# EAGLE design ain (EAGLE 6.5.0)
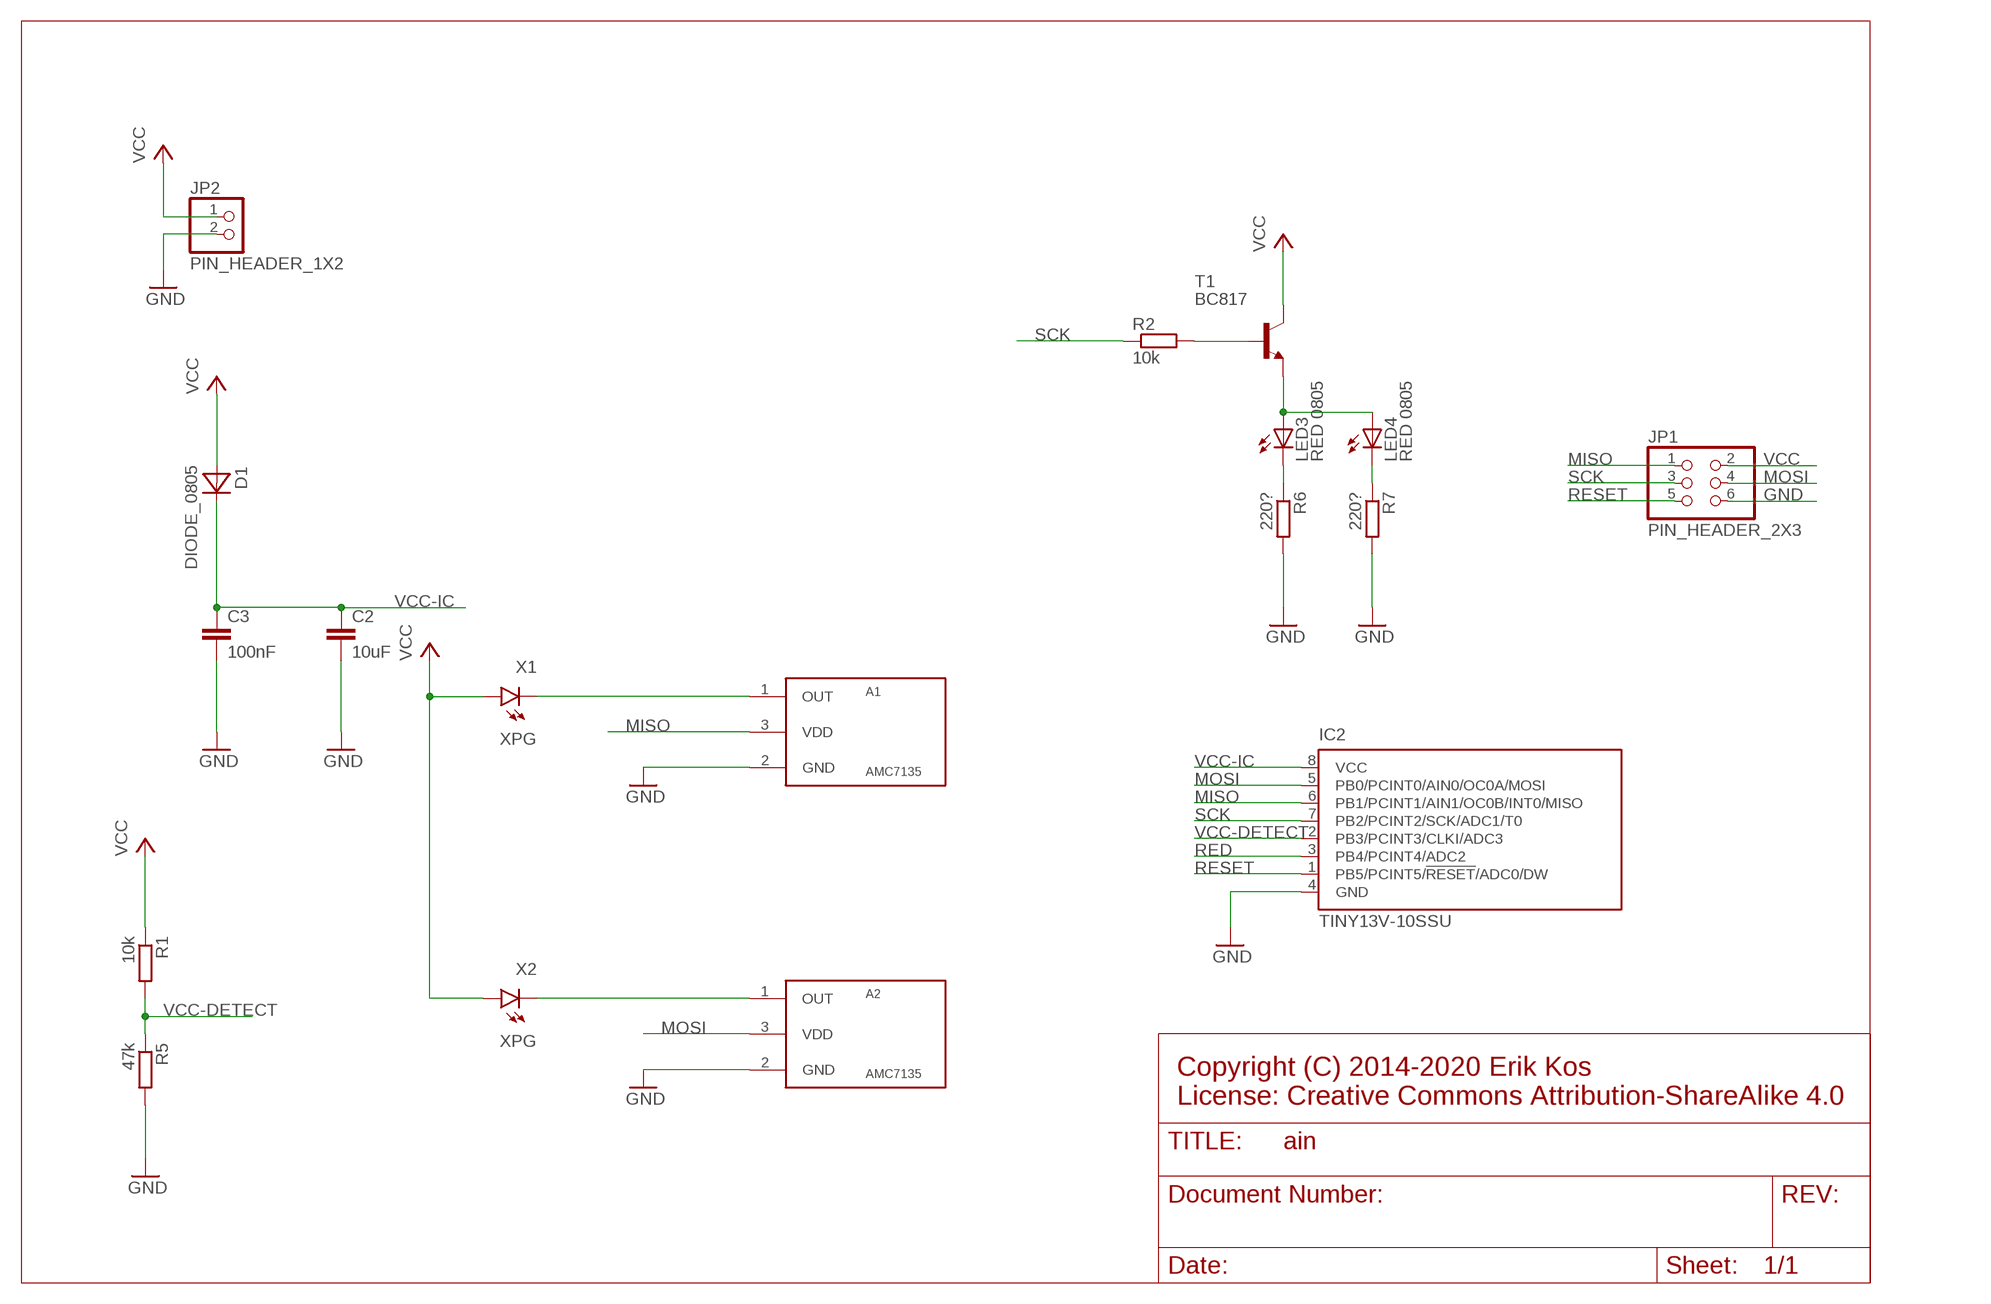
[diagram p0: schematic, sheet 1]

## Parts
A1  AMC7135  [SOT-89]
A2  AMC7135  [SOT-89]
C2  10uF  C-EUC0805  [C0805]
C3  100nF  C-EUC0805  [C0805]
D1  DIODE_0805  [0805]
IC2  TINY13V-10SSU  [8S1]
JP1  PIN_HEADER_2X3  [PIN_HEADER_2X3]
JP2  PIN_HEADER_1X2  [PIN_HEADER_1X2]
LED3  RED 0805  LEDSML0805  [SML0805]
LED4  RED 0805  LEDSML0805  [SML0805]
R1  10k  R-EU_M0805  [M0805]
R2  10k  R-EU_M0805  [M0805]
R5  47k  R-EU_M0805  [M0805]
R6  220?  R-EU_M0805  [M0805]
R7  220?  R-EU_M0805  [M0805]
T1  BC817  BC817-25-NPN-SOT23-BEC  [SOT23-BEC]
X1  XPG  [XPG]
X2  XPG  [XPG]

## Nets
GND: A1.2(GND) A2.2(GND) C2.2 C3.2 IC2.4(GND) JP1.6 JP2.2 R5.2 R6.2 R7.2
MISO: A1.3(VDD) IC2.6(PB1/PCINT1/AIN1/OC0B/INT0/MISO) JP1.1
MOSI: A2.3(VDD) IC2.5(PB0/PCINT0/AIN0/OC0A/MOSI) JP1.4
N$3: A2.1(OUT) X2.2(C)
N$4: A1.1(OUT) X1.2(C)
N$7: R2.2 T1.B
N$8: LED3.A LED4.A T1.E
N$9: LED4.C R7.1
N$10: LED3.C R6.1
RED: IC2.3(PB4/PCINT4/ADC2)
RESET: IC2.1(PB5/PCINT5/!RESET!/ADC0/DW) JP1.5
SCK: IC2.7(PB2/PCINT2/SCK/ADC1/T0) JP1.3 R2.1
VCC: D1.1(A) JP1.2 JP2.1 R1.1 T1.C X1.1(A) X2.1(A)
VCC-DETECT: IC2.2(PB3/PCINT3/CLKI/ADC3) R1.2 R5.1
VCC-IC: C2.1 C3.1 D1.2(C) IC2.8(VCC)

## Notes on the sheet
- Copyright (C) 2014-2020 Erik Kos
  License: Creative Commons Attribution-ShareAlike 4.0

## Library data of the parts
A1 A2 = js:AMC7135: AMC7135
C2 C3 = rcl:C-EU: CAPACITOR, European symbol
D1 = js:DIODE_0805
IC2 = atmel:TINY13: 8-bit AVR Microcontroller with 1K Bytes In-System Programmable Flash Source: http://www.atmel.com/dyn/resources/prod_documents/2535S.pdf; MPN: ATTINY13V-10SSU; OC_FARNELL: 1455135; OC_NEWARK: 58M3773
JP1 = js:PIN_HEADER_2X3
JP2 = js:PIN_HEADER_1X2
LED3 LED4 = led:LED: LED OSRAM: - CHIPLED LG R971, LG N971, LY N971, LG Q971, LY Q971, LO R971, LY R971 LH N974, LH R974 LS Q976, LO Q976, LY Q976 LO Q996 - Hyper CHIPLED LW Q18S LB Q993, LB Q99A, LB R99A - SideLED LS A670, LO A670, LY A670, LG A670, LP A670 LB A673, LV A673, LT A673, LW A673 LH A674 LY A675 LS A676, LA A676, LO A676, LY A676, LW A676 LS A679, LY A679, LG A679 - Hyper Micro SIDELED® LS Y876, LA Y876, LO Y876, LY Y876 LT Y87S - SmartLED LW L88C, LW L88S LB L89C, LB L89S, LG L890 LS L89K, LO L89K, LY L89K LS L896, LA L896, LO L896, LY L896 - TOPLED LS T670, LO T670, LY T670, LG T670, LP T670 LSG T670, LSP T670, LSY T670, LOP T670, LYG T670 LG T671, LOG T671, LSG T671 LB T673, LV T673, LT T673, LW T673 LH T674 LS T676, LA T676, LO T676, LY T676, LB T676, LH T676, LSB T676, LW T676 LB T67C, LV T67C, LT T67C, LS T67K, LO T67K, LY T67K, LW E67C LS E67B, LA E67B, LO E67B, LY E67B, LB E67C, LV E67C, LT E67C LW T67C LS T679, LY T679, LG T679 LS T770, LO T770, LY T770, LG T770, LP T770 LB T773, LV T773, LT T773, LW T773 LH T774 LS E675, LA E675, LY E675, LS T675 LS T776, LA T776, LO T776, LY T776, LB T776 LHGB T686 LT T68C, LB T68C - Hyper Mini TOPLED® LB M676 - Mini TOPLED Santana® LG M470 LS M47K, LO M47K, LY M47K Source: http://www.osram.convergy.de LUXEON: - LUMILED® LXK2-PW12-R00, LXK2-PW12-S00, LXK2-PW14-U00, LXK2-PW14-V00 LXK2-PM12-R00, LXK2-PM12-S00, LXK2-PM14-U00 LXK2-PE12-Q00, LXK2-PE12-R00, LXK2-PE12-S00, LXK2-PE14-T00, LXK2-PE14-U00 LXK2-PB12-K00, LXK2-PB12-L00, LXK2-PB12-M00, LXK2-PB14-N00, LXK2-PB14-P00, LXK2-PB14-Q00 LXK2-PR12-L00, LXK2-PR12-M00, LXK2-PR14-Q00, LXK2-PR14-R00 LXK2-PD12-Q00, LXK2-PD12-R00, LXK2-PD12-S00 LXK2-PH12-R00, LXK2-PH12-S00 LXK2-PL12-P00, LXK2-PL12-Q00, LXK2-PL12-R00 Source: www.luxeon.com KINGBRIGHT: KA-3528ASYC Source: www.kingbright.com
R1 R2 R5-R7 = rcl:R-EU_: RESISTOR, European symbol
T1 = transistor:*-NPN-: NPN Transistror BF959 corrected 2008.03.06
X1 X2 = js:XPG

## Net classes
0 default: clearance 0.205 mm

## Board
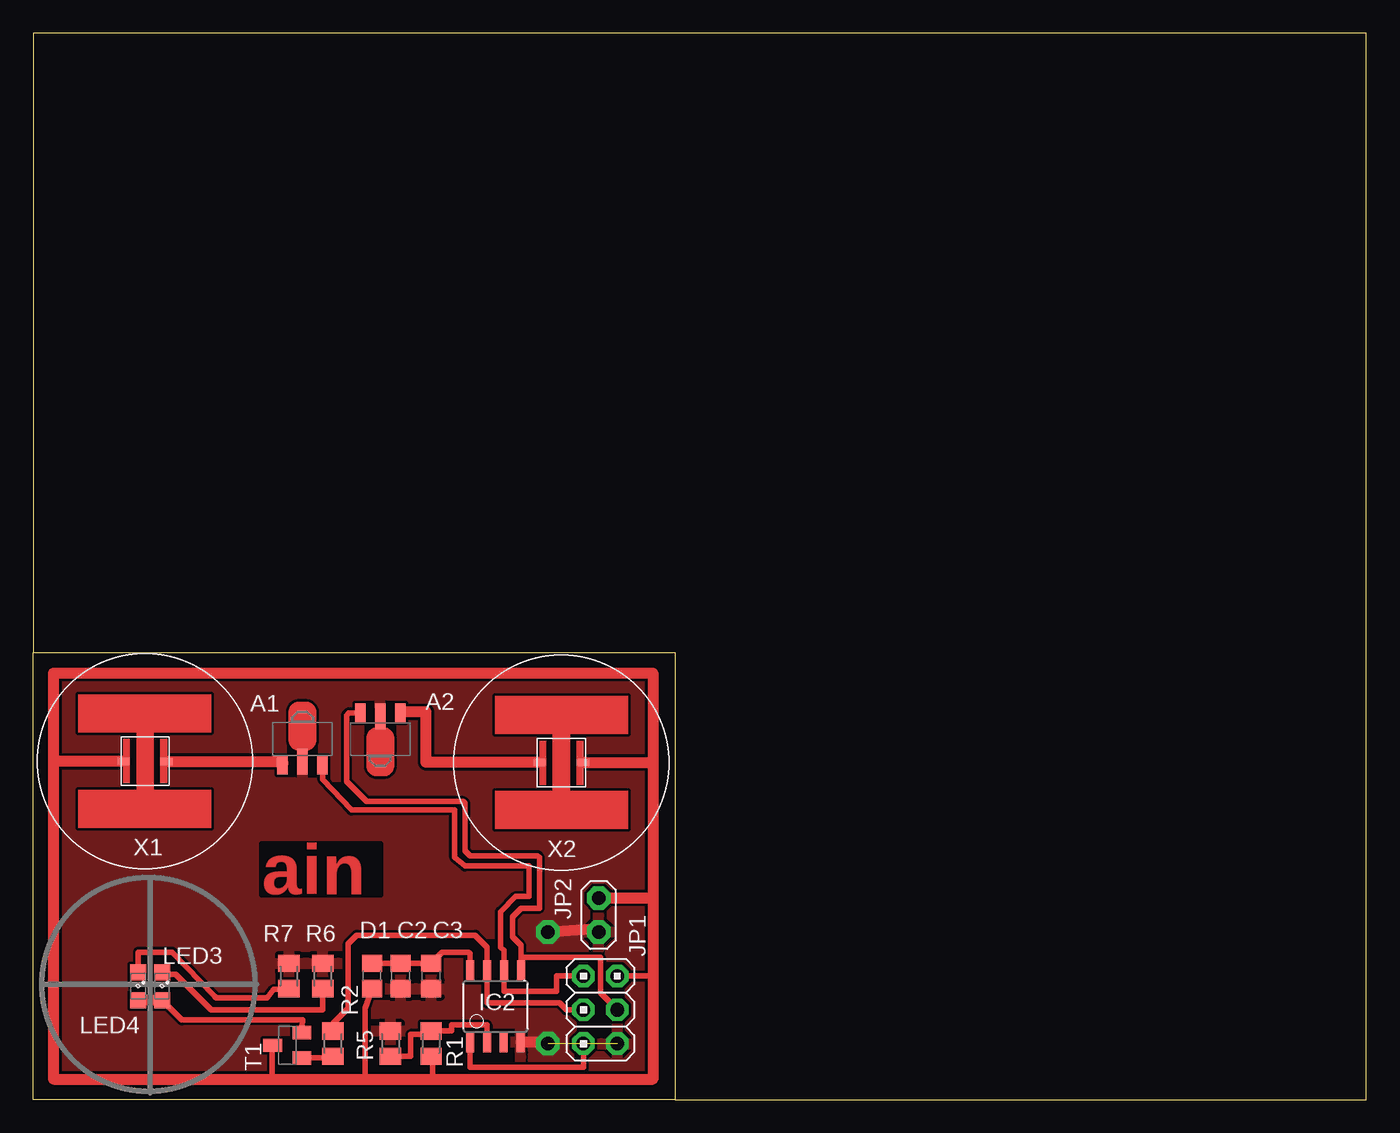
[diagram p1: board, top side]
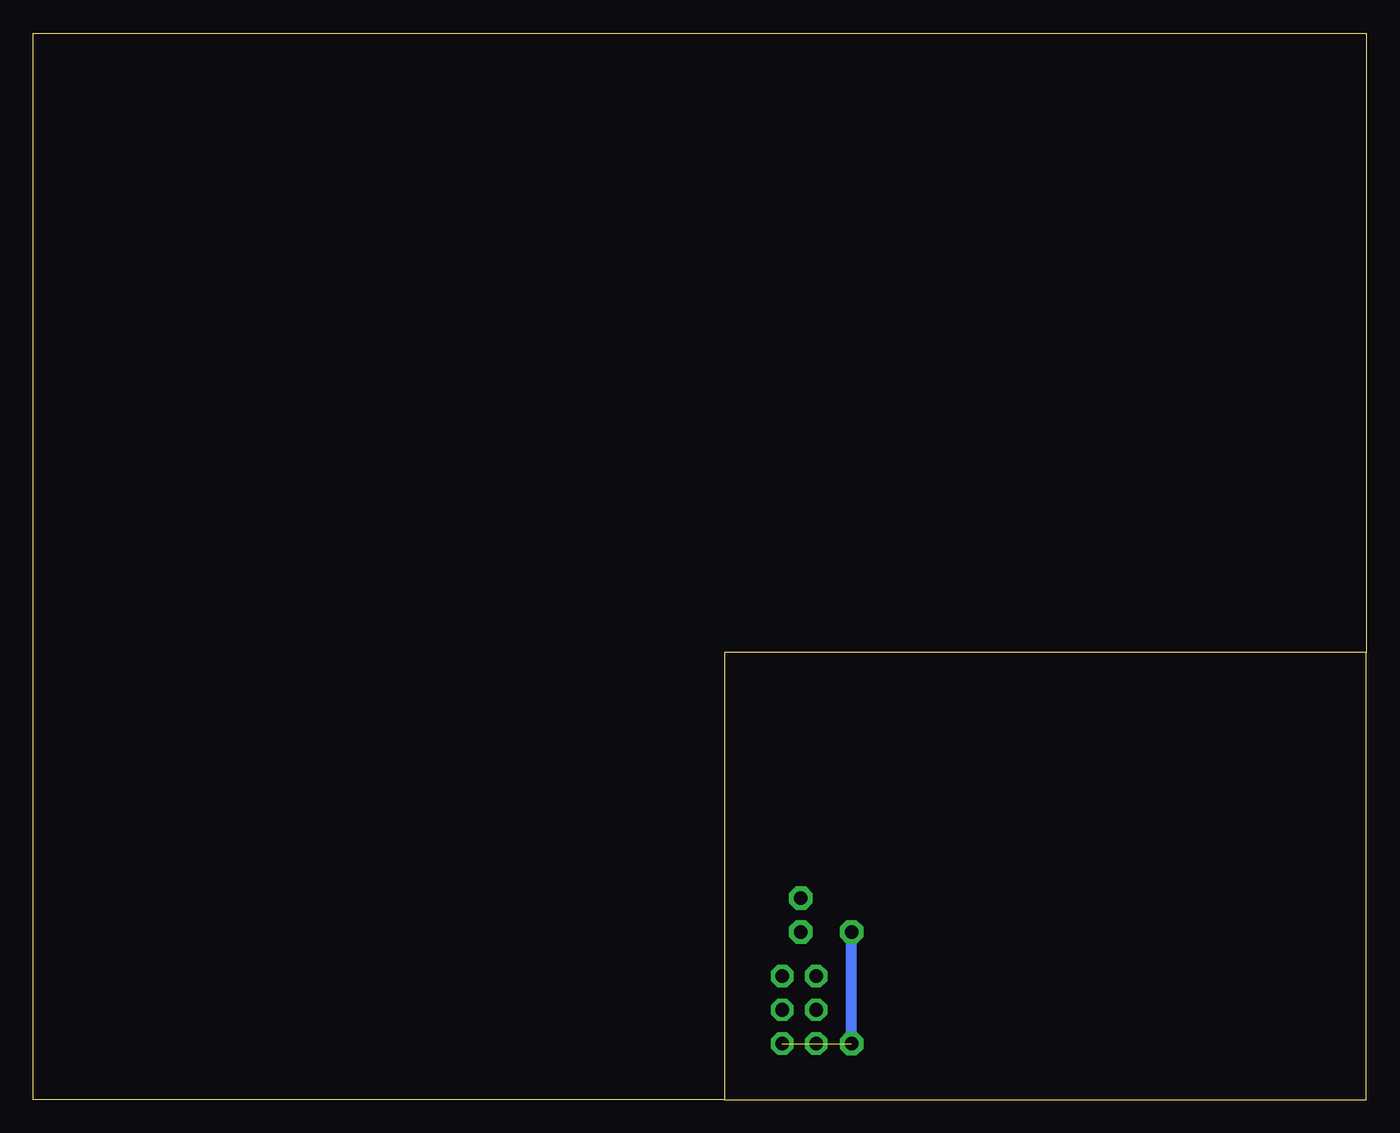
[diagram p2: board, bottom side, seen from below]

Size 100 x 80 mm. Coordinates in mm from the lower left corner, seen from the top.
Outline: 48.13,0 100,0 100,80 0,80 0,33.53
Outline: 0,33.53 48.13,33.53 48.13,0
Outline: 48.13,0 0,0 0,33.53
Copper layers (1*16): Top 0.035mm / dielectric 1.5mm / Bottom 0.035mm
Design rules "default": minimum track width 10mil, minimum drill 24mil, track to track 8mil, track to pad 8mil, pad to pad 8mil, via to via 8mil, smd to smd 8mil, copper to edge 40mil, drill to drill 8mil, minimum pad ring 10mil, minimum via ring 8mil, stop-mask expansion 4mil, vias tented up to drill 0mil, thermal gap 10mil

### Footprints (pad centres in the part's own frame; a part is rotated, then mirrored left to right if it is on the bottom)
SOT-89 = smd 0.8 x 1.4: 1 -1.626,-2.718; 3 1.372,-2.718 | smd 0.8 x 1.9: 2 -0.127,-2.464
C0805 = smd 1.3 x 1.5: 1 -0.95,0; 2 0.95,0
0805 = smd 1.3 x 1.5: 1 -0.95,0; 2 0.95,0
8S1 = smd 0.6 x 1.6: 1 -1.905,-2.654; 2 -0.645,-2.654; 3 0.625,-2.654; 4 1.895,-2.654; 5 1.905,2.654; 6 0.635,2.654; 7 -0.635,2.654; 8 -1.905,2.654
PIN_HEADER_2X3 = drill 1.016 pad 1.676 octagon: 1 -2.54,-1.27; 2 -2.54,1.27; 3 0,-1.27; 4 0,1.27; 5 2.54,-1.27 | drill 1 pad 1.676 octagon: 6 2.54,1.27
PIN_HEADER_1X2 = drill 1.016 pad 1.778 octagon: 1 1.27,0; 2 -1.27,0
SML0805 = smd 1.2 x 1.2: A 1.05,0; C -1.05,0
M0805 = smd 1.3 x 1.6: 1 -0.95,0; 2 0.95,0
SOT23-BEC = smd 1 x 1.4: B -0.95,-1.1; C 0,1.1; E 0.95,-1.1
XPG = smd 0.914 x 0.508: 1 -1.6,-0.025; 2 1.6,-0.025

### Placement (x,y rotation side)
A1  20.32,27.81 0 top
A2  25.91,26.29 180 top
C2  27.56,9.27 270 top
C3  29.84,9.27 270 top
D1  25.4,9.27 90 top
IC2  34.67,6.99 0 top
JP1  42.55,6.73 270 top
JP2  42.42,13.84 90 top
LED3  9.65,8.51 270 top
LED4  7.87,8.51 270 top
R1  29.84,4.19 90 top
R2  22.48,4.19 270 top
R5  26.8,4.19 90 top
R6  21.72,9.27 90 top
R7  19.18,9.27 90 top
T1  19.05,4.06 90 top
X1  8.38,25.4 0 top
X2  39.62,25.27 180 top

### Tracks (layer width: path | path; a pad name or v marks a point on that pad's centre or on a via)
GND  (via drill 1 pad 1.78)  (1 unrouted)
  Top 0.813: IC2.4 38.23,4.33 v38.61,4.19 | v38.61,12.57 42.42,12.83 JP2.2
  Bottom 0.813: v38.61,4.19 v38.61,12.57
  pour Top: 0.13,33.53 47.88,33.53 47.88,0 0.13,0
MISO
  Top 0.406: JP1.1 39.24,9.27 39.24,8.13 35.31,8.13 IC2.6 35.31,11.18 35.05,11.43 35.05,14.1 36.2,15.24 37.21,15.24 37.21,17.53 32.38,17.53 31.62,18.16 31.62,21.72 23.88,21.72 21.72,24 21.72,25.07 A1.3
MOSI
  Top 0.406: IC2.5 36.58,10.67 | 36.58,10.67 42.55,10.67 42.55,8 JP1.4 | 36.58,10.67 36.58,11.56 35.94,12.19 35.94,13.72 36.58,14.35 37.97,14.35 37.97,18.16 37.85,18.29 32.77,18.29 32.38,18.67 32.38,22.23 32.26,22.35 25.02,22.35 23.5,23.88 23.5,28.83 23.67,29.01 A2.3
N$1
  pour Top: 28.32,20.07 14.99,20.19 14.86,14.22 28.45,13.97
N$2
  pour Top: 14.86,20.32 28.45,20.32 28.7,14.1 15.11,14.1
N$3
  Top 0.813: X2.2 29.46,25.3 29.46,29.08 27.53,29.08 A2.1
N$4
  Top 0.813: X1.2 18.69,25.38 A1.1
N$7
  Top 0.406: T1.B 21.59,3.11 R2.2
N$8
  Top 0.406: T1.E 20.13,5.01 20.19,5.97 11.14,5.97 LED3.A
  Top 0.813: LED3.A LED4.A
N$9
  Top 0.406: LED4.C 7.87,11.05 10.41,11.05 13.59,7.75 13.72,7.62 17.53,7.62 18.03,8.26 19.11,8.26 R7.1
N$10
  Top 0.406: R6.1 21.72,6.73 13.34,6.73 10.67,9.4 9.81,9.4 LED3.C
RED
  Top 0.406: 35.18,4.19 IC2.3 | 35.18,4.21 IC2.3 | IC2.3
RESET
  Top 0.406: IC2.1 32.77,2.41 41.27,2.41 JP1.5
SCK
  Top 0.406: JP1.3 40.01,6.73 39.5,7.24 34.04,7.24 IC2.7 | IC2.7 34.01,9.64 | R2.1 22.48,5.71 23.62,6.86 23.62,11.68 24.26,12.32 33.15,12.32 34.04,11.43 IC2.7
VCC
  Top 0.406: R1.1 29.97,3.24 29.97,1.52 | JP1.2 46.48,9.27 | T1.C 17.91,4.06 17.91,1.52 | D1.1 24.89,6.86 24.89,1.52
  Top 0.813: 1.52,25.38 1.52,1.52 17.91,1.52 24.89,1.52 29.97,1.52 46.48,1.52 46.48,9.27 46.48,15.11 | 1.52,25.38 1.52,32 46.48,32 46.48,25.3 | JP2.1 46.48,15.11 | X1.1 1.52,25.38 | X2.1 46.48,25.3 | 46.48,25.3 46.48,15.11
VCC-DETECT
  Top 0.406: IC2.2 34.16,4.33 34.16,4.83 34.04,4.83 34.04,5.59 31.37,5.59 31.37,5.14 R1.2 29.59,4.89 28.32,4.89 28.32,3.24 R5.1
VCC-IC
  Top 0.406: D1.2 C2.1 C3.1 30.67,11.05 32.64,11.05 32.77,10.92 IC2.8

### Text on the board
Top: ain